# EAGLE schematic Safety Valve (EAGLE 9.1.3)

## Sheet 1 of 2
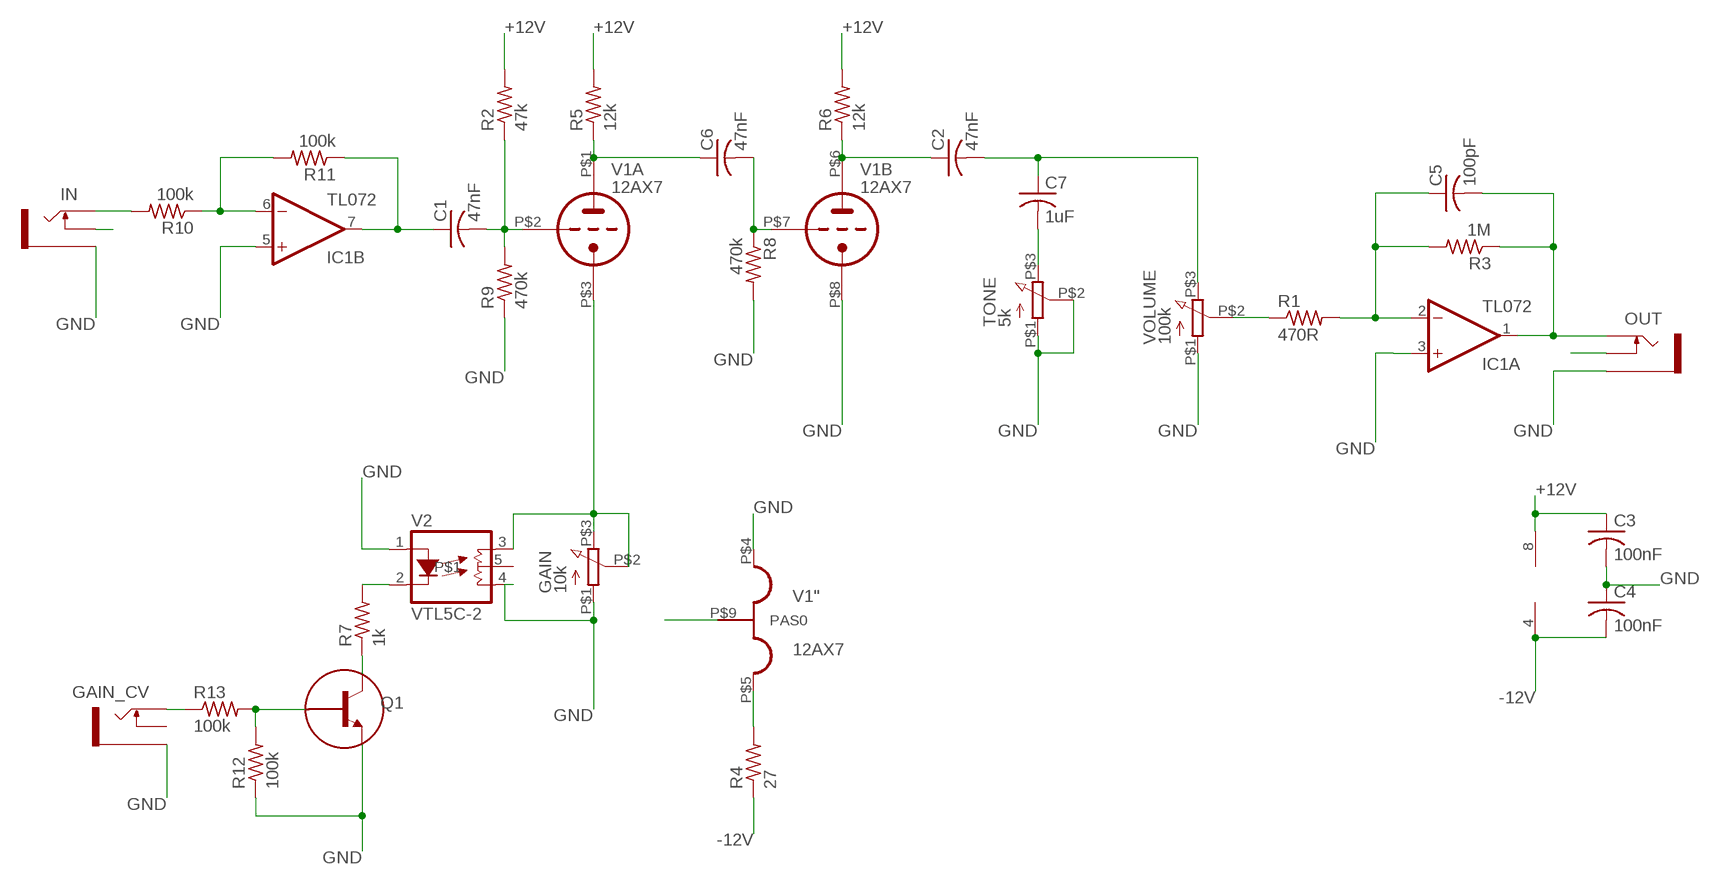
[diagram p0: schematic, sheet 1]

### Parts
C1  47nF  CAPACITOR-US025-024X044  [C025-024X044]
C2  47nF  CAPACITOR-US025-024X044  [C025-024X044]
C3  100nF  CAPACITOR-US025-024X044  [C025-024X044]
C4  100nF  CAPACITOR-US025-024X044  [C025-024X044]
C5  100pF  CAPACITOR-US025-024X044  [C025-024X044]
C6  47nF  CAPACITOR-US025-024X044  [C025-024X044]
C7  1uF  CAPACITOR-US050-024X044  [C050-024X044]
GAIN  10k  RESISTOR_VARIABLE9MM_POT  [POTENTIOMETER_9MM]
GAIN_CV  SOCKET_MONO_3.5MMPJ301M-12  [PJ301M-12]
IC1  TL072  OPAMP_DUALP  [DIL08]
IN  SOCKET_MONO_3.5MMPJ301M-12  [PJ301M-12]
OUT  SOCKET_MONO_3.5MMPJ301M-12  [PJ301M-12]
Q1  TRANSISTOR_NPNSOT23  [SOT23]
R1  470R  RESISTOR_US0207/10  [0207/10]
R2  47k  RESISTOR_US0207/10  [0207/10]
R3  1M  RESISTOR_US0207/10  [0207/10]
R4  27  RESISTOR_US0207/10  [0207/10]
R5  12k  RESISTOR_US0207/10  [0207/10]
R6  12k  RESISTOR_US0207/10  [0207/10]
R7  1k  RESISTOR_US0207/10  [0207/10]
R8  470k  RESISTOR_US0207/10  [0207/10]
R9  470k  RESISTOR_US0207/10  [0207/10]
R10  100k  RESISTOR_US0207/10  [0207/10]
R11  100k  RESISTOR_US0207/10  [0207/10]
R12  100k  RESISTOR_US0207/10  [0207/10]
R13  100k  RESISTOR_US0207/10  [0207/10]
TONE  5k  RESISTOR_VARIABLE9MM_POT  [POTENTIOMETER_9MM]
V1  12AX7  VALVE_12AX7-P  [12AX7]
V2  VTL5C-2  [VTL5C-2]
VOLUME  100k  RESISTOR_VARIABLE9MM_POT  [POTENTIOMETER_9MM]

### Nets
+12V: C3.1 IC1.8(P:V+) R2.2 R5.2 R6.2 ; also sheet 2
-12V: C4.2 IC1.4(P:V-) R4.1 ; also sheet 2
GND: C3.2 C4.1 GAIN.P$1 GAIN_CV.GND(SLEEVE) IC1.3(A:+IN) IC1.5(B:+IN) IN.GND(SLEEVE) OUT.GND(SLEEVE) Q1.2(E) R8.2 R9.1 R12.1 TONE.P$1 TONE.P$2 V1.P$4(":H1) V1.P$8(B:TK) V2.1(A) V2.4(L2) VOLUME.P$1 ; also sheet 2
N$1: GAIN.P$2 GAIN.P$3 V1.P$3(A:TK) V2.3(L1)
N$2: C5.1 IC1.2(A:-IN) R1.2 R3.2
N$3: C2.2 C7.1 VOLUME.P$3
N$4: C5.2 IC1.1(A:OUT) OUT.TIP R3.1
N$5: C2.1 R6.1 V1.P$6(B:TA)
N$6: C6.1 R5.1 V1.P$1(A:TA)
N$7: C1.2 R2.1 R9.2 V1.P$2(A:TG)
N$8: IN.NORM(SWITCH)
N$9: OUT.NORM(SWITCH)
N$10: C1.1 IC1.7(B:OUT) R11.1
N$11: R4.2 V1.P$5(":H3)
N$12: C6.2 R8.1 V1.P$7(B:TG)
N$14: IN.TIP R10.2
N$15: V1.P$9(":PAS0)
N$17: C7.2 TONE.P$3
N$18: IC1.6(B:-IN) R10.1 R11.2
N$19: R1.1 VOLUME.P$2
N$20: GAIN_CV.TIP R13.1
N$21: Q1.1(B) R12.2 R13.2
N$22: R7.2 V2.2(C)
N$24: Q1.3(C) R7.1
Unconnected: GAIN_CV.NORM(SWITCH) V2.5

## Sheet 2 of 2: Power
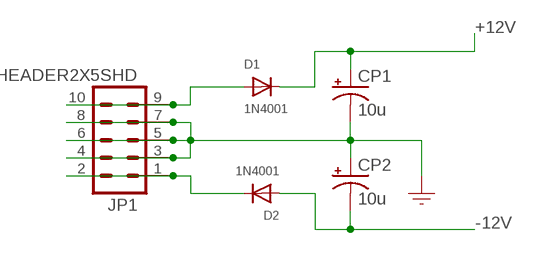
[diagram p1: schematic, sheet 2]

### Parts
CP1  10u  CAPACITOR_POL-USSANYO_D  [SANYO-OSCON_D]
CP2  10u  CAPACITOR_POL-USSANYO_D  [SANYO-OSCON_D]
D1  1N4001  DIODEDO-41  [DO-41]
D2  1N4001  DIODEDO-41  [DO-41]
JP1  HEADER2X5SHD  [2X5-SHROUDED]

### Nets
+12V: CP1.+ D1.C ; also sheet 1
-12V: CP2.- D2.A ; also sheet 1
GND: CP1.- CP2.+ JP1.3 JP1.4 JP1.5 JP1.6 JP1.7 JP1.8 ; also sheet 1
N$13: D1.A JP1.9 JP1.10
N$16: D2.C JP1.1 JP1.2

## Library data of the parts
C1-C6 = GMSN:CAPACITOR-US: Capacitor; SORT: 3; SPICEPREFIX: C
C7 = GMSN:CAPACITOR-US: Capacitor; SPICEPREFIX: C
CP1 CP2 = GMSN:CAPACITOR_POL-US: Electro Capacitor; SORT: 6; SPICEPREFIX: C
D1 D2 = GMSN:DIODE: Diode SMADIODE - SMA Surface Mount Package 20V 1A Schottky Diode Digikey: 641-1014-6-ND DO-1N4148 - Through Hole Small Current Diode SOD-123 20V 1 A (.5mV Vf) Schottky Diode - Digikey: MBRX120TPMSCT-ND SOD-323 10V 570mA (.38mV Vf, 3ns) Schottky Diode - Digikey: ZLLS410CT-ND SOD-523 30V 30mA Schottky Diode (RB751S-40TE61) - Digikey: RB751S-40TE61CT-ND SOT23-R/W - SOT23 Package (R = Solder Paste/Reflow Ovens, W = Hand-Soldering) BAT54Film 40V 300mA - Digikey: 497-7162-1-ND; SORT: 1; SPICEMODEL: DMOD; SPICEPREFIX: D
GAIN TONE VOLUME = GMSN:RESISTOR_VARIABLE: Potentiometer; SORT: 8; SPICEPREFIX: X
GAIN_CV IN = GMSN:SOCKET_MONO_3.5MM: 3.5 mm Jack Socket; SORT: 8; SPICEMODEL: SocketMonoSigIn; SPICEPREFIX: X
IC1 = GMSN:OPAMP_DUAL: Dual Op Amp; SORT: 5; SPICEMODEL: TL072; SPICEPREFIX: X
JP1 = GMSN:HEADER2X5: Header 5x2 Standard 10-pin dual row 0.1" header. Commonly used with AVR-ISP. Use with Spark Fun Electronics SKU: PRT-00778; SORT: 7; SPICEMODEL: EuroPower; SPICEPREFIX: X
OUT = GMSN:SOCKET_MONO_3.5MM: 3.5 mm Jack Socket; SORT: 8; SPICEMODEL: SocketMono; SPICEPREFIX: X
Q1 = GMSN:TRANSISTOR_NPN: Generic NPN BJT MMBT2222A - TRANS-08049 (SOT-23, 1A 40V) MPSA42 - TRANS-09116 (SOT-23, 500mA 300V) MMBT5088LT1G - TRANS-11160 (SOT-23, 50 mA 30V); SORT: 4
R1-R13 = GMSN:RESISTOR_US: Resistor; SORT: 2; SPICEPREFIX: R
V1 = GMSN:VALVE_12AX7-P; SPICEMODEL: 12ax7; SPICEPREFIX: X
V2 = TomW:VTL5C-2: VTL5C/2 five pin vactrol